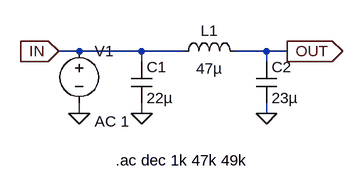
[diagram p0: schematic InputFilter.asc]
InputFilter.asc, the LTspice schematic file:
Version 4
SHEET 1 880 680
WIRE 16 96 -16 96
WIRE 112 96 16 96
WIRE 176 96 112 96
WIRE 304 96 256 96
WIRE 336 96 304 96
WIRE 112 112 112 96
WIRE 304 112 304 96
WIRE 16 192 16 176
WIRE 112 192 112 176
WIRE 304 192 304 176
FLAG 112 192 0
FLAG 304 192 0
FLAG -16 96 IN
IOPIN -16 96 In
FLAG 336 96 OUT
IOPIN 336 96 Out
FLAG 16 192 0
SYMBOL cap 96 112 R0
SYMATTR InstName C1
SYMATTR Value 22µ
SYMBOL cap 288 112 R0
SYMATTR InstName C2
SYMATTR Value 23µ
SYMBOL ind 160 112 R270
WINDOW 0 32 56 VTop 2
WINDOW 3 5 56 VBottom 2
SYMATTR InstName L1
SYMATTR Value 47µ
SYMATTR SpiceLine Rser=2.53
SYMBOL voltage 16 80 R0
WINDOW 123 24 124 Left 2
WINDOW 39 0 0 Left 0
SYMATTR Value2 AC 1
SYMATTR InstName V1
SYMATTR Value ""
TEXT 72 264 Left 2 !.ac dec 1k 47k 49k

The netlist it stands for:
* InputFilter.asc
C1 IN 0 22µ
C2 OUT 0 23µ
L1 IN OUT 47µ Rser=2.53
V1 IN 0 AC 1
.ac dec 1k 47k 49k
.backanno
.end